# EAGLE schematic MPU-9250 (EAGLE 7.6.0)
DESIGNER: Brent Wilkins; VERSION: v10
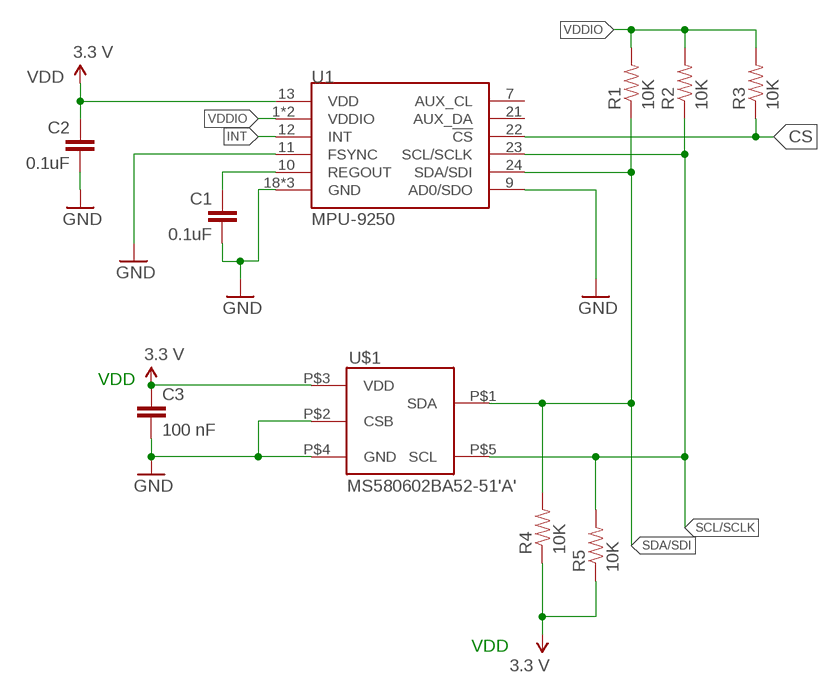
[diagram p0: schematic, sheet 1]

## Parts
C1  0.1uF  0.1UF-25V(+80/-20%)(0603)  [0603-CAP]
C2  0.1uF  0.1UF-25V(+80/-20%)(0603)  [0603-CAP]
C3  100 nF  CC4564  [C4564]
R1  10K  10KOHM-1/10W-1%(0603)0603  [0603-RES]
R2  10K  10KOHM-1/10W-1%(0603)0603  [0603-RES]
R3  10K  10KOHM-1/10W-1%(0603)0603  [0603-RES]
R4  10K  10KOHM-1/10W-1%(0603)0603  [0603-RES]
R5  10K  10KOHM-1/10W-1%(0603)0603  [0603-RES]
U1  MPU-9250  [QFN24_PAD]
U$1  MS580602BA52-51'A'  [MS5806-02BA]

## Nets
CS: R3.1 U1.22(!CS)
GND: C1.2 C2.2 C3.2 U1.9(AD0/SDO) U1.11(FSYNC) U1.18(GND) U1.20(GND) U1.CENTER(GND) U$1.P$2(CSB) U$1.P$4(GND)
INT: U1.12(INT)
REGOUT: C1.1 U1.10(REGOUT)
SCL/SCLK: R2.1 R5.2 U1.23(SCL/SCLK) U$1.P$5(SCL)
SDA/SDI: R1.1 R4.2 U1.24(SDA/SDI) U$1.P$1(SDA)
VDD: C2.1 C3.1 R4.1 R5.1 U1.13(VDD) U$1.P$3(VDD) ; supply symbol labelled 3.3 V
VDDIO: R1.2 R2.2 R3.2 U1.1(VDDIO) U1.8(VDDIO)
Unconnected: U1.7(AUX_CL) U1.21(AUX_DA)

## Notes on the sheet
- VDD
- VDD
- VDD

## Library data of the parts
C1 C2 = SparkFun-Capacitors:0.1UF-25V(+80/-20%)(0603): CAP-00810 Ceramic Standard decoupling cap; PROD_ID: CAP-00810
C3 = eagle-ltspice:C: CAPACITOR, European symbol; SPICEMODEL: NONE; SPICEPREFIX: C
R1-R5 = SparkFun-Resistors:10KOHM-1/10W-1%(0603): RES-00824; PROD_ID: RES-00824
U1 = Testing:MPU-9250: NC pin 19. 2-6 & 14-17 not internally connected. May be used for PCB trace routing.; PROD_ID: IC-13192
U$1 = myLibrary:MS580602BA52-51